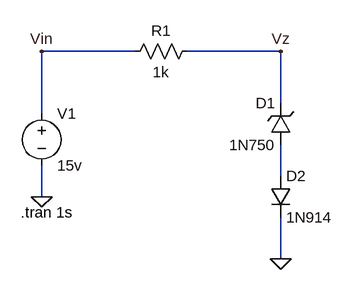
[diagram p0: schematic 2.3.asc]
2.3.asc, the LTspice schematic file:
Version 4
SHEET 1 880 680
WIRE 288 80 144 80
WIRE 512 80 368 80
WIRE 512 160 512 80
WIRE 144 176 144 80
WIRE 512 272 512 224
WIRE 144 304 144 256
WIRE 512 400 512 336
FLAG 144 304 0
FLAG 512 80 Vz
FLAG 144 80 Vin
FLAG 512 400 0
SYMBOL voltage 144 160 R0
SYMATTR InstName V1
SYMATTR Value 15v
SYMBOL res 384 64 R90
WINDOW 0 0 56 VBottom 2
WINDOW 3 32 56 VTop 2
SYMATTR InstName R1
SYMATTR Value 1k
SYMBOL zener 528 224 R180
WINDOW 0 24 64 Left 2
WINDOW 3 24 0 Left 2
SYMATTR InstName D1
SYMATTR Value 1N750
SYMATTR Description Diode
SYMATTR Type diode
SYMBOL diode 496 272 R0
SYMATTR InstName D2
SYMATTR Value 1N914
TEXT 112 328 Left 2 !.tran 1s

The netlist it stands for:
* 2.3.asc
V1 Vin 0 15v
R1 Vz Vin 1k
D1 N001 Vz 1N750
D2 N001 0 1N914
.model D D
.lib standard.dio
.tran 1s
.backanno
.end